# EAGLE schematic borrador_1 (EAGLE 9.5.2)
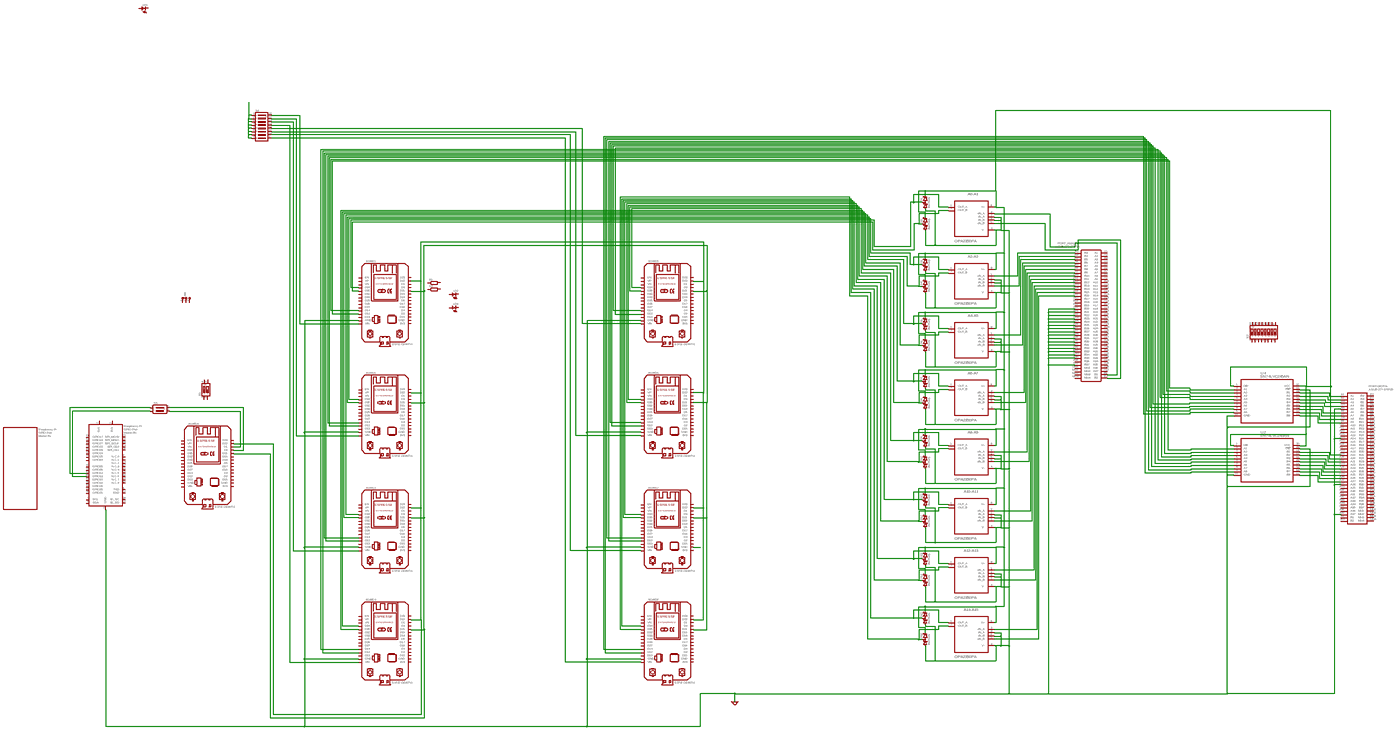
[diagram p0: schematic, sheet 1, overview]
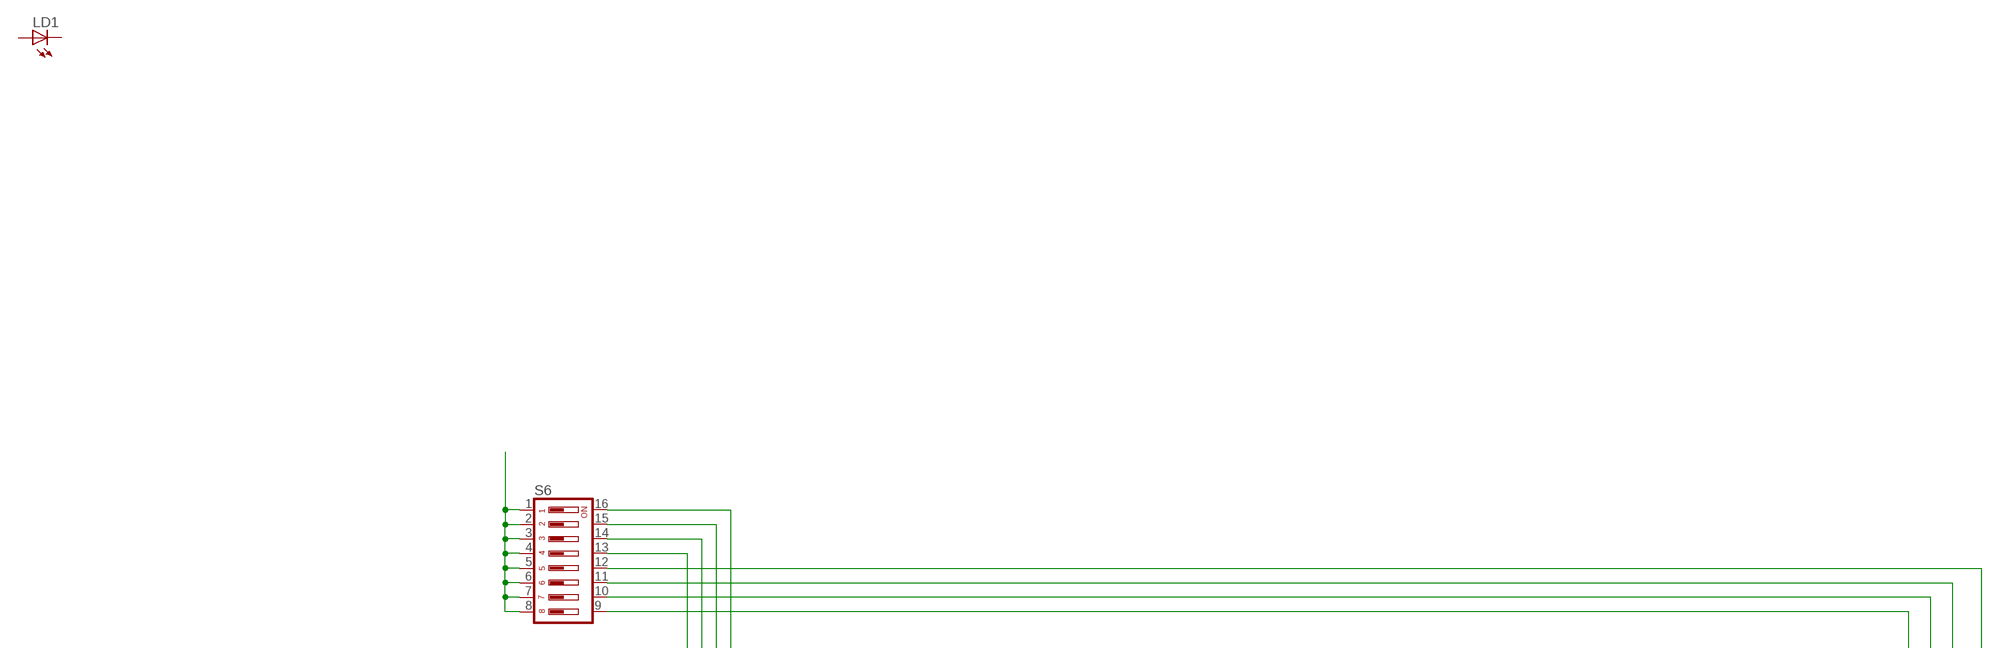
[diagram p1: schematic, sheet 1, part 1 of 4]
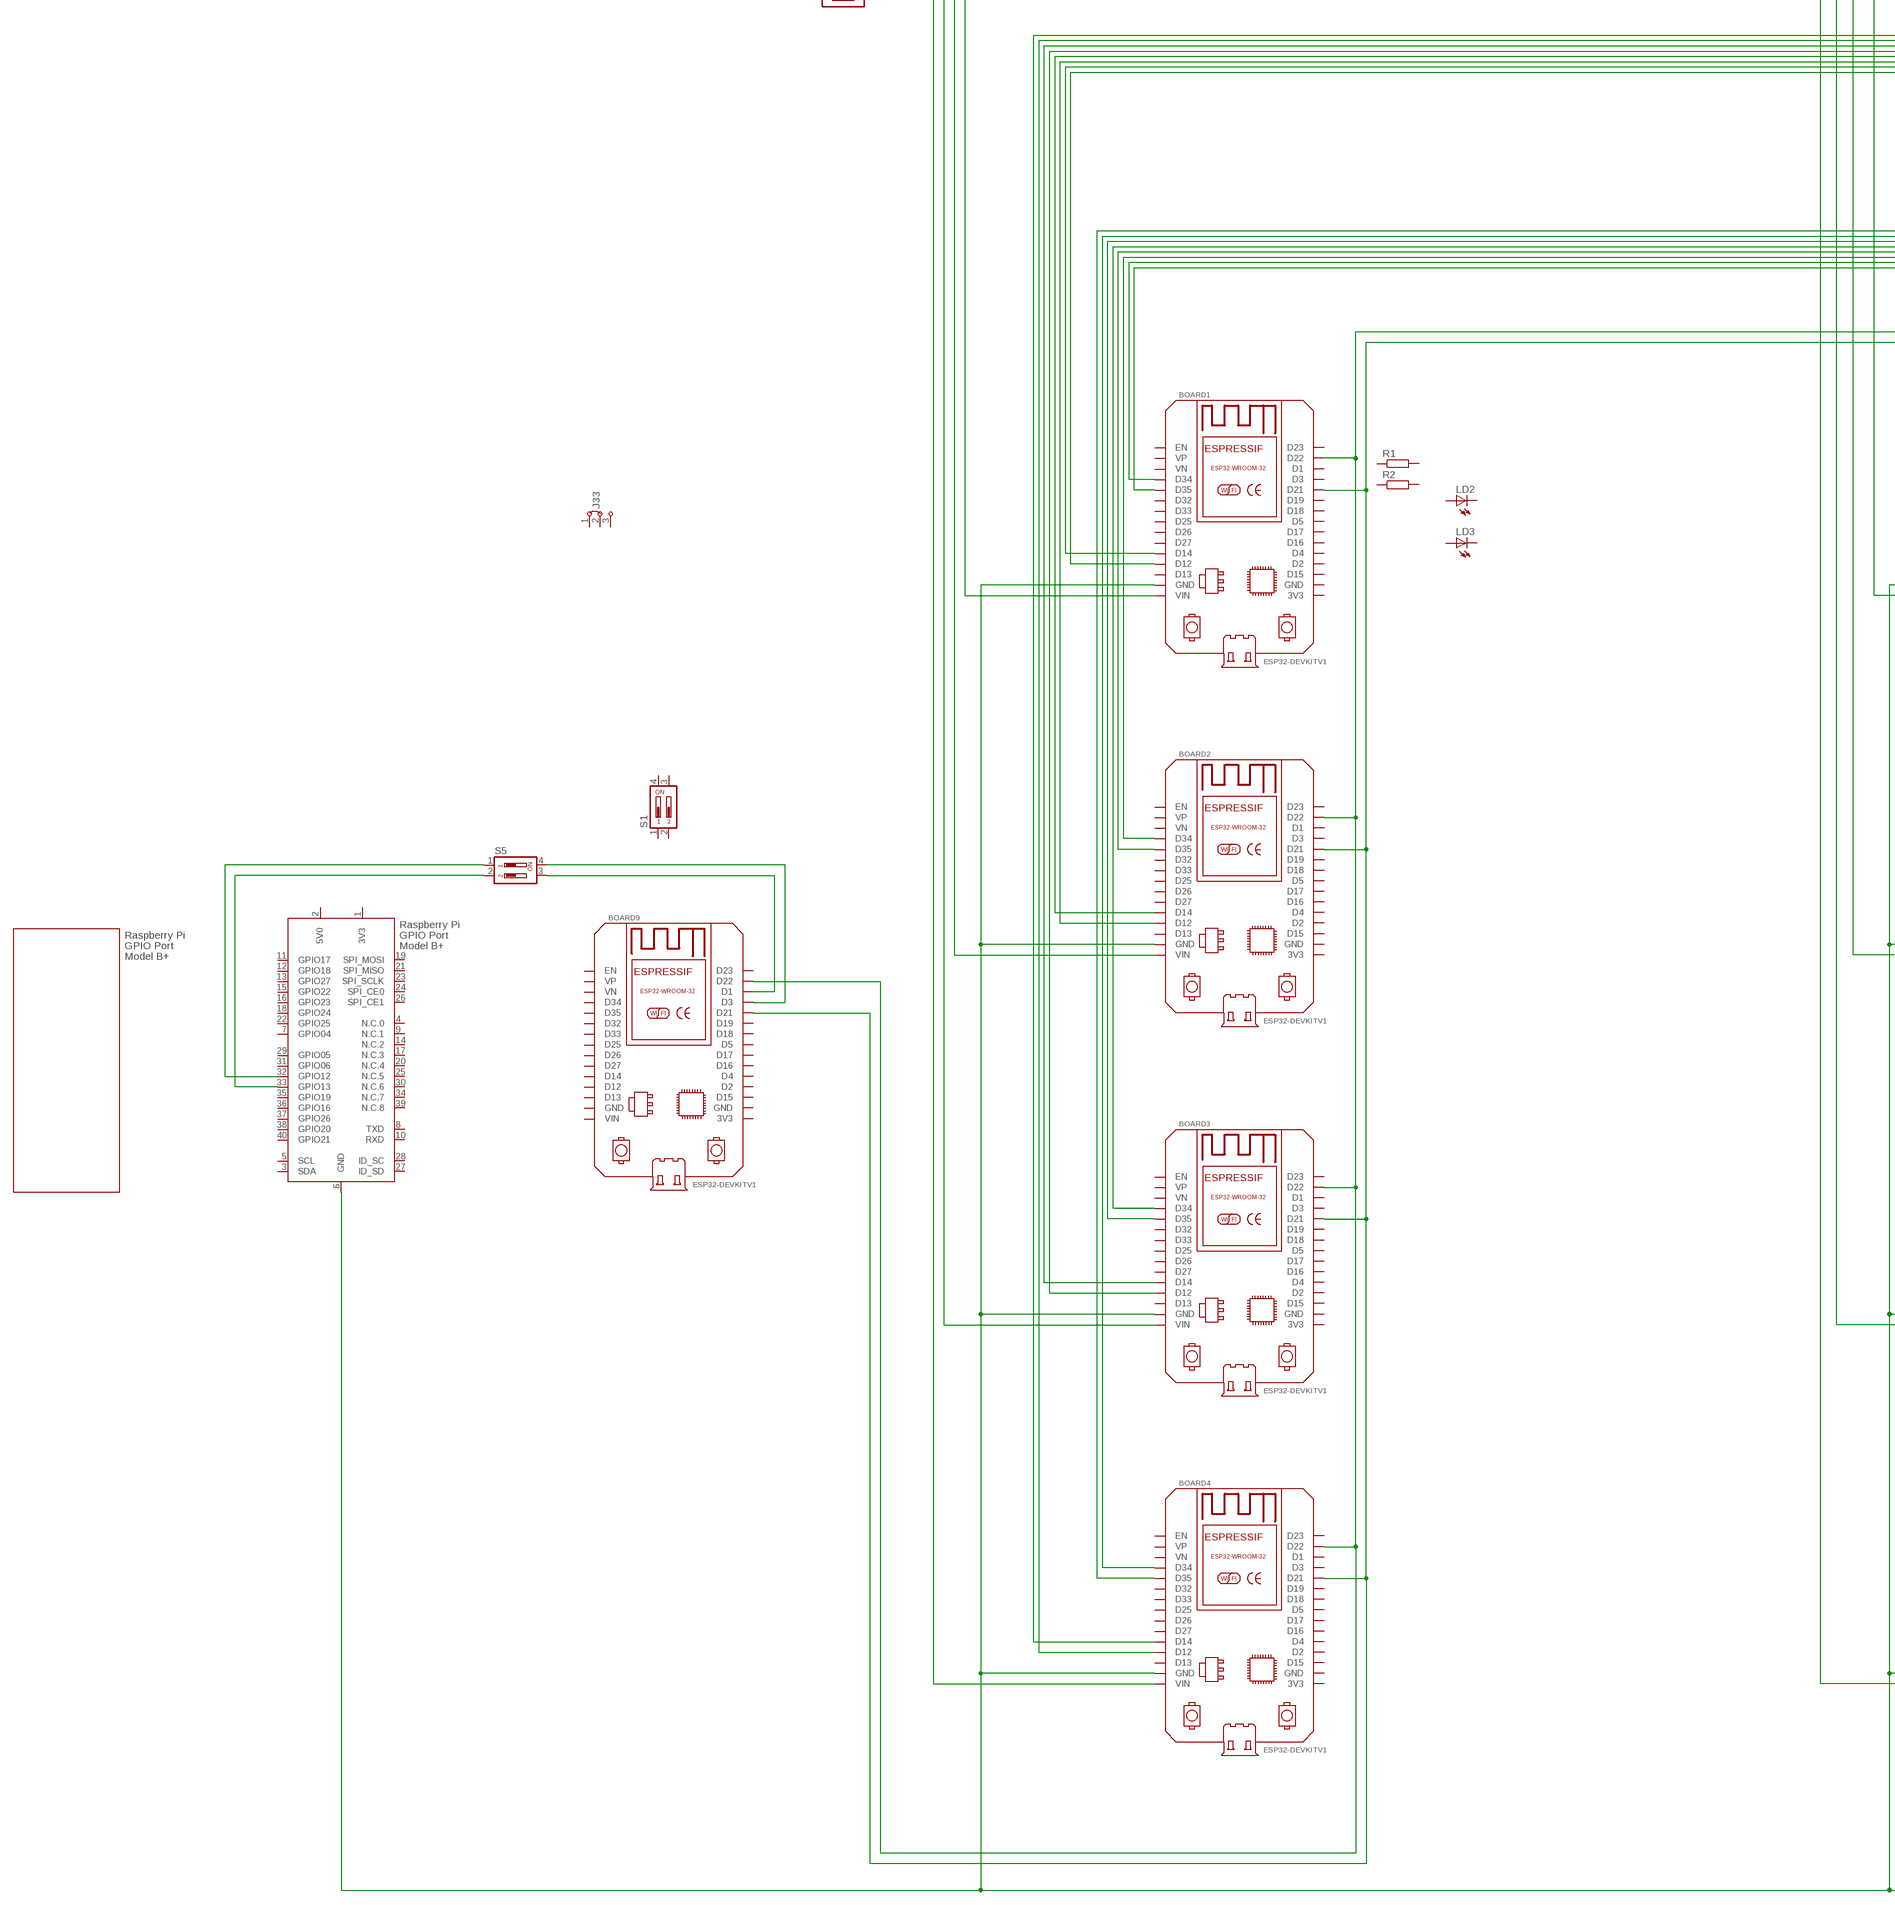
[diagram p2: schematic, sheet 1, part 2 of 4]
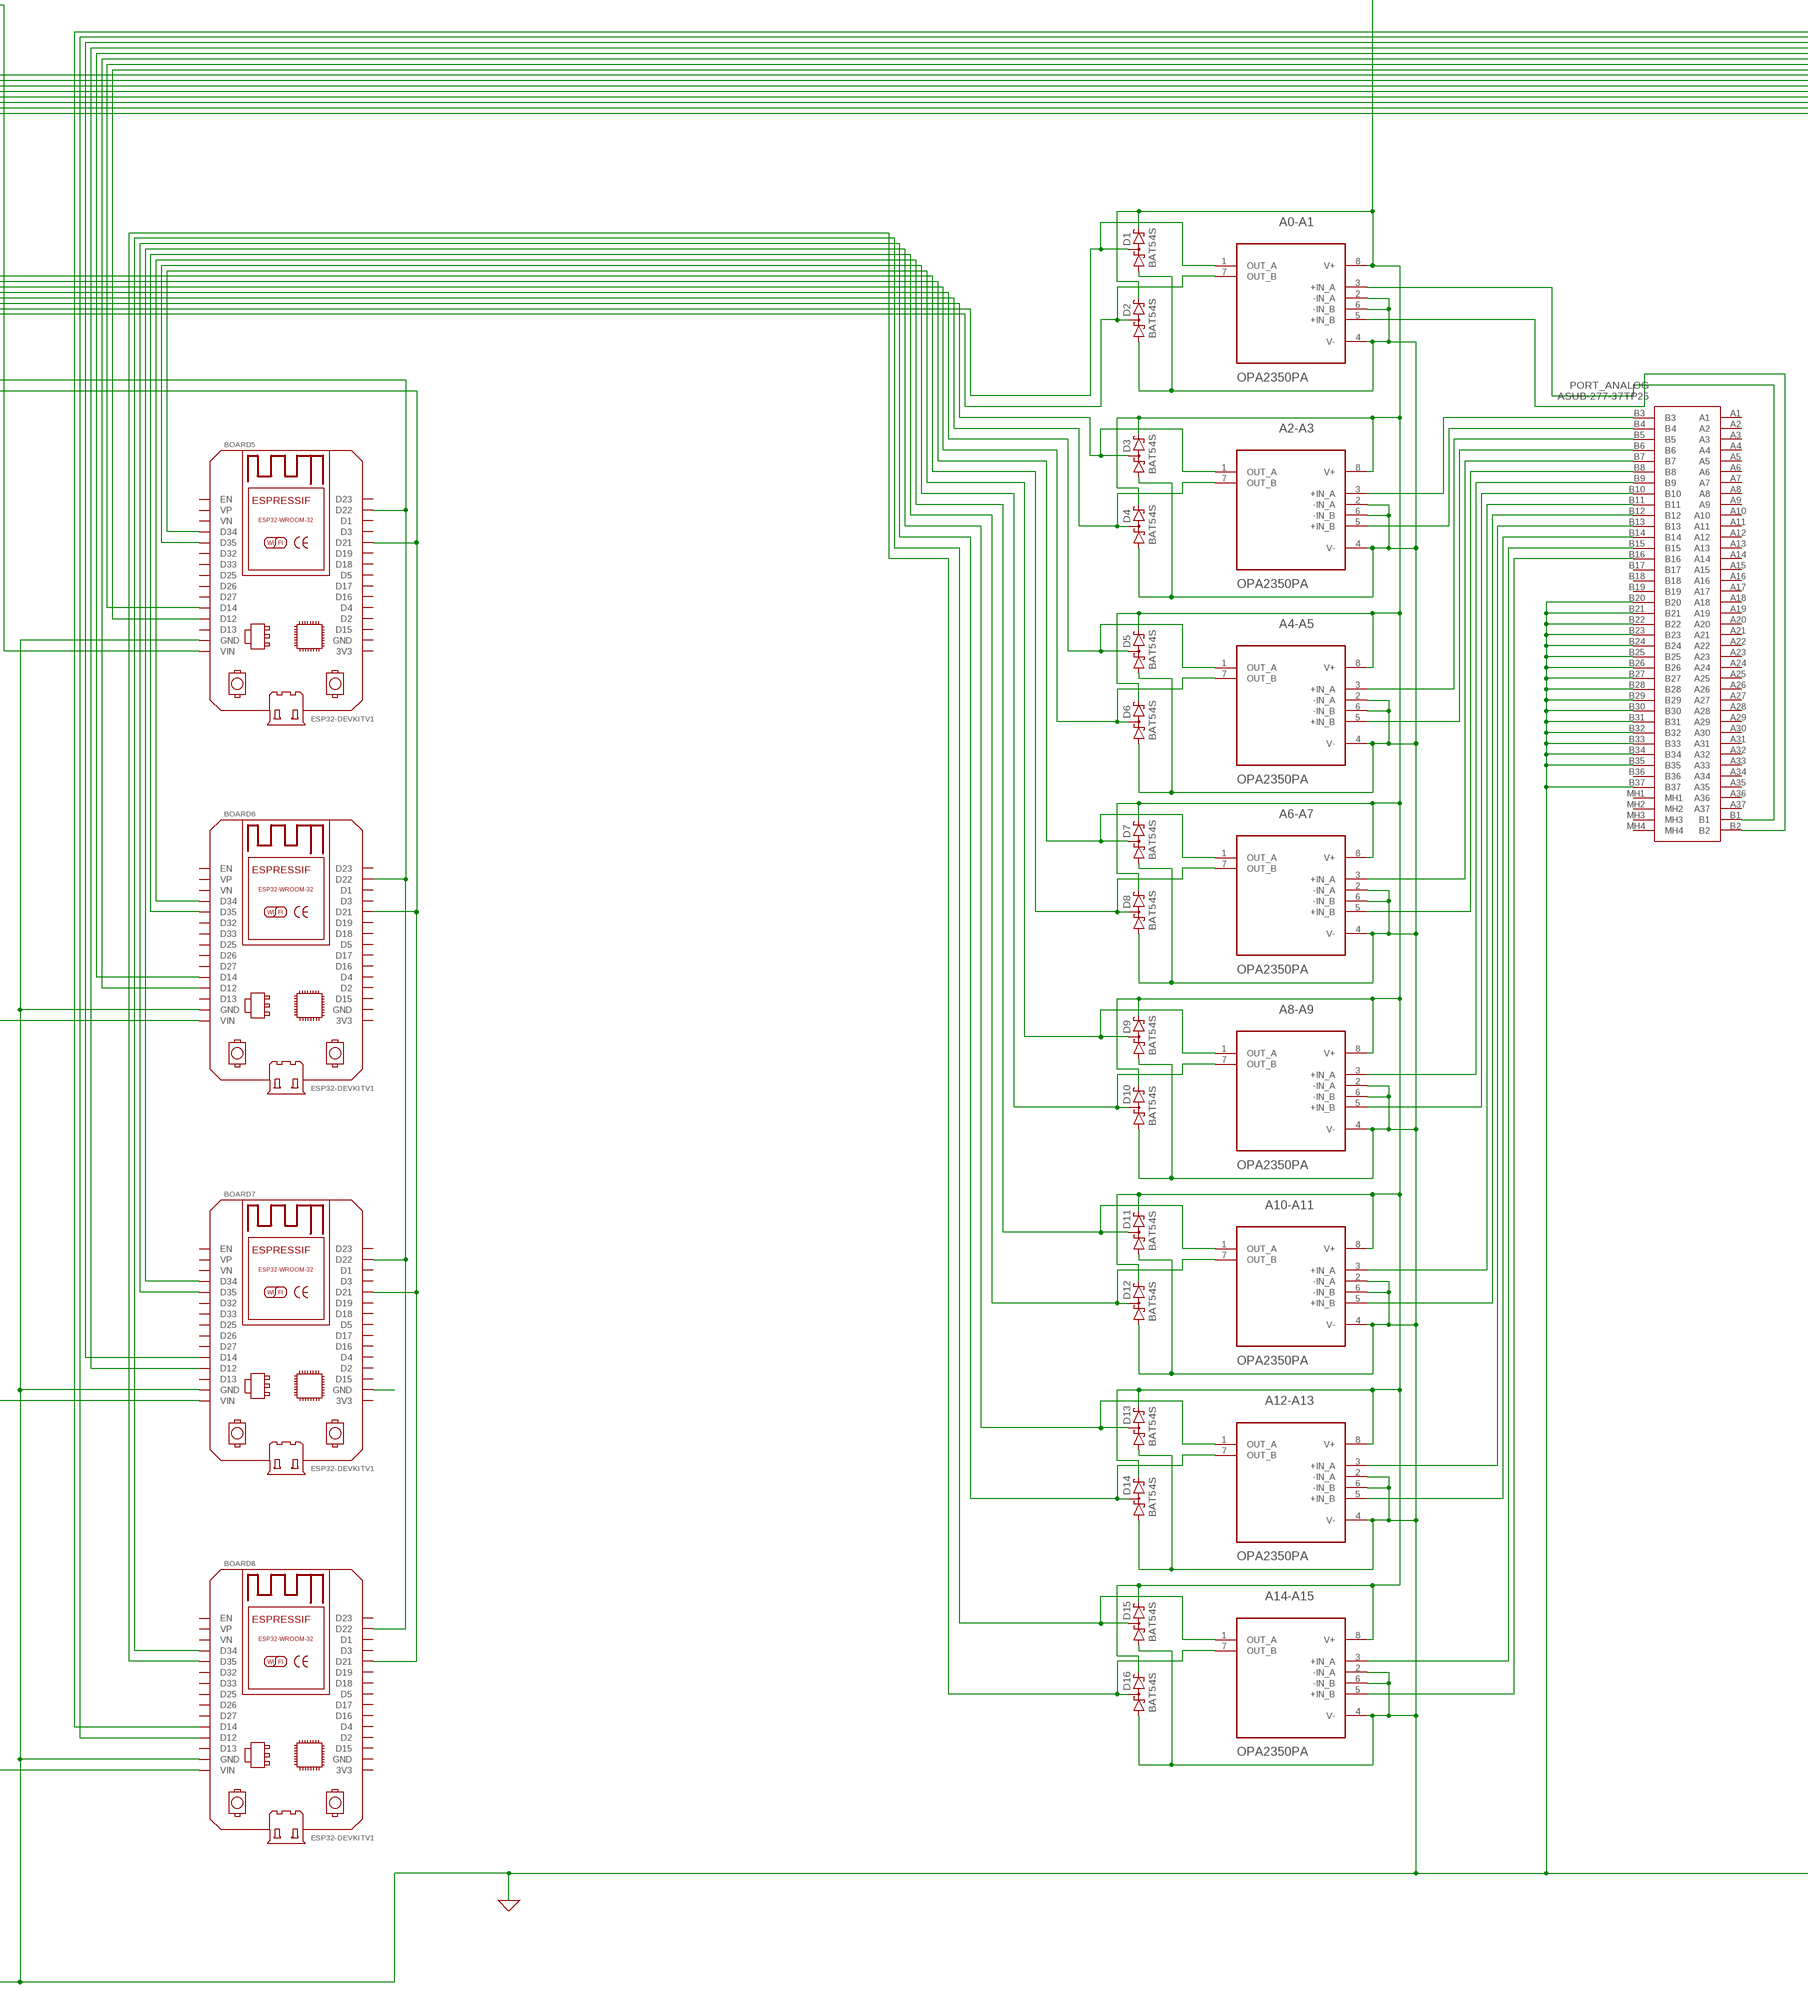
[diagram p3: schematic, sheet 1, part 3 of 4]
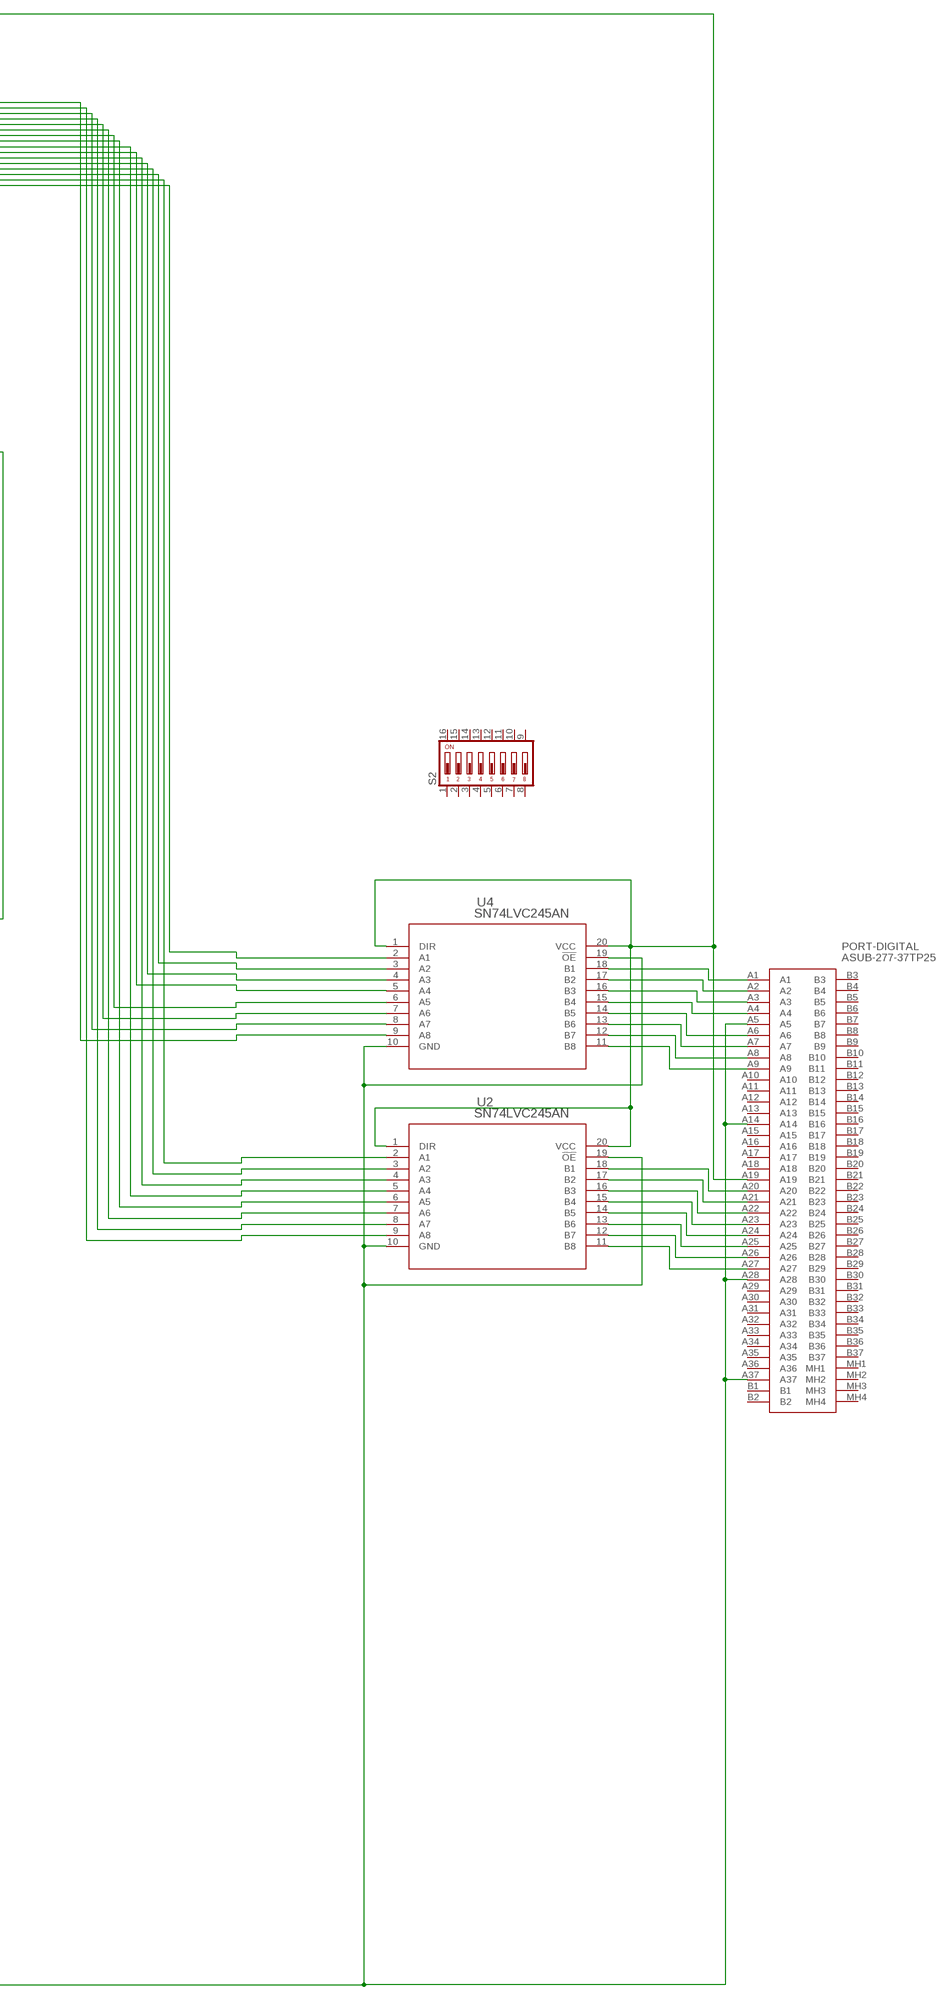
[diagram p4: schematic, sheet 1, part 4 of 4]

## Parts
A0-A1  OPA2350PA  [DIP254P762X508-8]
A2-A3  OPA2350PA  [DIP254P762X508-8]
A4-A5  OPA2350PA  [DIP254P762X508-8]
A6-A7  OPA2350PA  [DIP254P762X508-8]
A8-A9  OPA2350PA  [DIP254P762X508-8]
A10-A11  OPA2350PA  [DIP254P762X508-8]
A12-A13  OPA2350PA  [DIP254P762X508-8]
A14-A15  OPA2350PA  [DIP254P762X508-8]
BOARD1  ESP32DEVKITV1  [ESP32-DEVKITV1]
BOARD2  ESP32DEVKITV1  [ESP32-DEVKITV1]
BOARD3  ESP32DEVKITV1  [ESP32-DEVKITV1]
BOARD4  ESP32DEVKITV1  [ESP32-DEVKITV1]
BOARD5  ESP32DEVKITV1  [ESP32-DEVKITV1]
BOARD6  ESP32DEVKITV1  [ESP32-DEVKITV1]
BOARD7  ESP32DEVKITV1  [ESP32-DEVKITV1]
BOARD8  ESP32DEVKITV1  [ESP32-DEVKITV1]
BOARD9  ESP32DEVKITV1  [ESP32-DEVKITV1]
D1  BAT54S  [SOT23]
D2  BAT54S  [SOT23]
D3  BAT54S  [SOT23]
D4  BAT54S  [SOT23]
D5  BAT54S  [SOT23]
D6  BAT54S  [SOT23]
D7  BAT54S  [SOT23]
D8  BAT54S  [SOT23]
D9  BAT54S  [SOT23]
D10  BAT54S  [SOT23]
D11  BAT54S  [SOT23]
D12  BAT54S  [SOT23]
D13  BAT54S  [SOT23]
D14  BAT54S  [SOT23]
D15  BAT54S  [SOT23]
D16  BAT54S  [SOT23]
J33  J2X2MM  [04C]
LD1  LED3MM  [LED3MM]
LD2  LED3MM  [LED3MM]
LD3  LED3MM  [LED3MM]
PORT-DIGITAL  ASUB-277-37TP25  [ASUB27737TP25]
PORT_ANALOG  ASUB-277-37TP25  [ASUB27737TP25]
R1  R-EU_0207/10  [0207/10]
R2  R-EU_0207/10  [0207/10]
S1  DS02  [DS-02]
S2  DS08  [DS-08]
S5  DS02  [DS-02]
S6  DS08  [DS-08]
U2  SN74LVC245AN  [N20]
U4  SN74LVC245AN  [N20]
X1  RASPI_GPIO_B+_BOX  [RASPI_GPIO_B+_BOX]
X2  RASPI_BOARD_B+#_F  [RASPI_BOARD_B+_FULL]

## Nets
5V_MOD1: BOARD1.VIN S6.16
5V_MOD2: BOARD2.VIN S6.15
5V_MOD3: BOARD3.VIN S6.14
5V_MOD4: BOARD4.VIN S6.13
5V_MOD5: BOARD5.VIN S6.12
5V_MOD6: BOARD6.VIN S6.11
5V_MOD7: BOARD7.VIN S6.10
5V_MOD8: BOARD8.VIN S6.9
L_3V3: A0-A1.8(V+) A2-A3.8(V+) A4-A5.8(V+) A6-A7.8(V+) A8-A9.8(V+) A10-A11.8(V+) A12-A13.8(V+) A14-A15.8(V+) D1.2(C2) D2.2(C2) D3.2(C2) D4.2(C2) D5.2(C2) D6.2(C2) D7.2(C2) D8.2(C2) D9.2(C2) D10.2(C2) D11.2(C2) D12.2(C2) D13.2(C2) D14.2(C2) D15.2(C2) D16.2(C2) PORT-DIGITAL.A19 U2.1(DIR) U2.20(VCC) U4.1(DIR) U4.20(VCC)
L_5V: S6.1 S6.2 S6.3 S6.4 S6.5 S6.6 S6.7 S6.8
L_AO_0: A0-A1.1(OUT_A) BOARD1.D34 D1.3(C1A2)
L_AO_0_P: A0-A1.3(+IN_A) PORT_ANALOG.B1
L_AO_1: A0-A1.7(OUT_B) BOARD1.D35 D2.3(C1A2)
L_AO_1_P: A0-A1.5(+IN_B) PORT_ANALOG.B2
L_AO_2: A2-A3.1(OUT_A) BOARD2.D34 D3.3(C1A2)
L_AO_2_P: A2-A3.3(+IN_A) PORT_ANALOG.B3
L_AO_3: A2-A3.7(OUT_B) BOARD2.D35 D4.3(C1A2)
L_AO_3_P: A2-A3.5(+IN_B) PORT_ANALOG.B4
L_AO_4: A4-A5.1(OUT_A) BOARD3.D34 D5.3(C1A2)
L_AO_4_P: A4-A5.3(+IN_A) PORT_ANALOG.B5
L_AO_5: A4-A5.7(OUT_B) BOARD3.D35 D6.3(C1A2)
L_AO_5_P: A4-A5.5(+IN_B) PORT_ANALOG.B6
L_AO_6: A6-A7.1(OUT_A) BOARD4.D34 D7.3(C1A2)
L_AO_6_P: A6-A7.3(+IN_A) PORT_ANALOG.B7
L_AO_7: A6-A7.7(OUT_B) BOARD4.D35 D8.3(C1A2)
L_AO_7_P: A6-A7.5(+IN_B) PORT_ANALOG.B8
L_AO_8: A8-A9.1(OUT_A) BOARD5.D34 D9.3(C1A2)
L_AO_8_P: A8-A9.3(+IN_A) PORT_ANALOG.B9
L_AO_9: A8-A9.7(OUT_B) BOARD5.D35 D10.3(C1A2)
L_AO_9_P: A8-A9.5(+IN_B) PORT_ANALOG.B10
L_AO_10: A10-A11.1(OUT_A) BOARD6.D34 D11.3(C1A2)
L_AO_10_P: A10-A11.3(+IN_A) PORT_ANALOG.B11
L_AO_11: A10-A11.7(OUT_B) BOARD6.D35 D12.3(C1A2)
L_AO_11_P: A10-A11.5(+IN_B) PORT_ANALOG.B12
L_AO_12: A12-A13.1(OUT_A) BOARD7.D34 D13.3(C1A2)
L_AO_12_P: A12-A13.3(+IN_A) PORT_ANALOG.B13
L_AO_13: A12-A13.7(OUT_B) BOARD7.D35 D14.3(C1A2)
L_AO_13_P: A12-A13.5(+IN_B) PORT_ANALOG.B14
L_AO_14: A14-A15.1(OUT_A) BOARD8.D34 D15.3(C1A2)
L_AO_14_P: A14-A15.3(+IN_A) PORT_ANALOG.B15
L_AO_15: A14-A15.7(OUT_B) BOARD8.D35 D16.3(C1A2)
L_AO_15_P: A14-A15.5(+IN_B) PORT_ANALOG.B16
L_DI_0: BOARD1.D12 U4.2(A1)
L_DI_0_P: PORT-DIGITAL.A1 U4.18(B1)
L_DI_1: BOARD1.D14 U2.2(A1)
L_DI_1_P: PORT-DIGITAL.A20 U2.18(B1)
L_DI_2: BOARD2.D12 U4.3(A2)
L_DI_2_P: PORT-DIGITAL.A2 U4.17(B2)
L_DI_3: BOARD2.D14 U2.3(A2)
L_DI_3_P: PORT-DIGITAL.A21 U2.17(B2)
L_DI_4: BOARD3.D12 U4.4(A3)
L_DI_4_P: PORT-DIGITAL.A3 U4.16(B3)
L_DI_5: BOARD3.D14 U2.4(A3)
L_DI_5_P: PORT-DIGITAL.A22 U2.16(B3)
L_DI_6: BOARD4.D12 U4.5(A4)
L_DI_6_P: PORT-DIGITAL.A4 U4.15(B4)
L_DI_7: BOARD4.D14 U2.5(A4)
L_DI_7_P: PORT-DIGITAL.A23 U2.15(B4)
L_DI_8: BOARD5.D12 U2.6(A5)
L_DI_8_P: PORT-DIGITAL.A24 U2.14(B5)
L_DI_9: BOARD5.D14 U4.6(A5)
L_DI_9_P: PORT-DIGITAL.A6 U4.14(B5)
L_DI_10: BOARD6.D12 U2.7(A6)
L_DI_10_P: PORT-DIGITAL.A25 U2.13(B6)
L_DI_11: BOARD6.D14 U4.7(A6)
L_DI_11_P: PORT-DIGITAL.A7 U4.13(B6)
L_DI_012: BOARD7.D12 U2.8(A7)
L_DI_12_P: PORT-DIGITAL.A26 U2.12(B7)
L_DI_13: BOARD7.D14 U4.8(A7)
L_DI_13_P: PORT-DIGITAL.A8 U4.12(B7)
L_DI_014: BOARD8.D12 U2.9(A8)
L_DI_14_P: PORT-DIGITAL.A27 U2.11(B8)
L_DI_015: BOARD8.D14 U4.9(A8)
L_DI_15_P: PORT-DIGITAL.A9 U4.11(B8)
L_GROUND: A0-A1.2(-IN_A) A0-A1.4(V-) A0-A1.6(-IN_B) A2-A3.2(-IN_A) A2-A3.4(V-) A2-A3.6(-IN_B) A4-A5.2(-IN_A) A4-A5.4(V-) A4-A5.6(-IN_B) A6-A7.2(-IN_A) A6-A7.4(V-) A6-A7.6(-IN_B) A8-A9.2(-IN_A) A8-A9.4(V-) A8-A9.6(-IN_B) A10-A11.2(-IN_A) A10-A11.4(V-) A10-A11.6(-IN_B) A12-A13.2(-IN_A) A12-A13.4(V-) A12-A13.6(-IN_B) A14-A15.2(-IN_A) A14-A15.4(V-) A14-A15.6(-IN_B) BOARD1.GND BOARD2.GND BOARD3.GND BOARD4.GND BOARD5.GND BOARD6.GND BOARD7.GND BOARD8.GND D1.1(A1) D2.1(A1) D3.1(A1) D4.1(A1) D5.1(A1) D6.1(A1) D7.1(A1) D8.1(A1) D9.1(A1) D10.1(A1) D11.1(A1) D12.1(A1) D13.1(A1) D14.1(A1) D15.1(A1) D16.1(A1) PORT-DIGITAL.A5 PORT-DIGITAL.A14 PORT-DIGITAL.A28 PORT-DIGITAL.A37 PORT_ANALOG.B20 PORT_ANALOG.B21 PORT_ANALOG.B22 PORT_ANALOG.B23 PORT_ANALOG.B24 PORT_ANALOG.B25 PORT_ANALOG.B26 PORT_ANALOG.B27 PORT_ANALOG.B28 PORT_ANALOG.B29 PORT_ANALOG.B30 PORT_ANALOG.B31 PORT_ANALOG.B32 PORT_ANALOG.B33 PORT_ANALOG.B34 PORT_ANALOG.B35 PORT_ANALOG.B37 U2.10(GND) U2.19(!OE) U4.10(GND) U4.19(!OE) X1.6(GND) ; supply symbol labelled GND
L_SCL: BOARD1.D22 BOARD2.D22 BOARD3.D22 BOARD4.D22 BOARD5.D22 BOARD6.D22 BOARD7.D22 BOARD8.D22 BOARD9.D22
L_SDA: BOARD1.D21 BOARD2.D21 BOARD3.D21 BOARD4.D21 BOARD5.D21 BOARD6.D21 BOARD7.D21 BOARD8.D21 BOARD9.D21
N$1: S5.2 X1.33(GPIO13)
N$2: BOARD7.GND@1(GND)
N$3: S5.1 X1.32(GPIO12)
N$4: BOARD9.D3 S5.4
N$5: BOARD9.D1 S5.3
Unconnected: BOARD1.3V3 BOARD1.D1 BOARD1.D2 BOARD1.D3 BOARD1.D4 BOARD1.D5 BOARD1.D13 BOARD1.D15 BOARD1.D16 BOARD1.D17 BOARD1.D18 BOARD1.D19 BOARD1.D23 BOARD1.D25 BOARD1.D26 BOARD1.D27 BOARD1.D32 BOARD1.D33 BOARD1.EN BOARD1.GND@1(GND) BOARD1.VN BOARD1.VP BOARD2.3V3 BOARD2.D1 BOARD2.D2 BOARD2.D3 BOARD2.D4 BOARD2.D5 BOARD2.D13 BOARD2.D15 BOARD2.D16 BOARD2.D17 BOARD2.D18 BOARD2.D19 BOARD2.D23 BOARD2.D25 BOARD2.D26 BOARD2.D27 BOARD2.D32 BOARD2.D33 BOARD2.EN BOARD2.GND@1(GND) BOARD2.VN BOARD2.VP BOARD3.3V3 BOARD3.D1 BOARD3.D2 BOARD3.D3 BOARD3.D4 BOARD3.D5 BOARD3.D13 BOARD3.D15 BOARD3.D16 BOARD3.D17 BOARD3.D18 BOARD3.D19 BOARD3.D23 BOARD3.D25 BOARD3.D26 BOARD3.D27 BOARD3.D32 BOARD3.D33 BOARD3.EN BOARD3.GND@1(GND) BOARD3.VN BOARD3.VP BOARD4.3V3 BOARD4.D1 BOARD4.D2 BOARD4.D3 BOARD4.D4 BOARD4.D5 BOARD4.D13 BOARD4.D15 BOARD4.D16 BOARD4.D17 BOARD4.D18 BOARD4.D19 BOARD4.D23 BOARD4.D25 BOARD4.D26 BOARD4.D27 BOARD4.D32 BOARD4.D33 BOARD4.EN BOARD4.GND@1(GND) BOARD4.VN BOARD4.VP BOARD5.3V3 BOARD5.D1 BOARD5.D2 BOARD5.D3 BOARD5.D4 BOARD5.D5 BOARD5.D13 BOARD5.D15 BOARD5.D16 BOARD5.D17 BOARD5.D18 BOARD5.D19 BOARD5.D23 BOARD5.D25 BOARD5.D26 BOARD5.D27 BOARD5.D32 BOARD5.D33 BOARD5.EN BOARD5.GND@1(GND) BOARD5.VN BOARD5.VP BOARD6.3V3 BOARD6.D1 BOARD6.D2 BOARD6.D3 BOARD6.D4 BOARD6.D5 BOARD6.D13 BOARD6.D15 BOARD6.D16 BOARD6.D17 BOARD6.D18 BOARD6.D19 BOARD6.D23 BOARD6.D25 BOARD6.D26 BOARD6.D27 BOARD6.D32 BOARD6.D33 BOARD6.EN BOARD6.GND@1(GND) BOARD6.VN BOARD6.VP BOARD7.3V3 BOARD7.D1 BOARD7.D2 BOARD7.D3 BOARD7.D4 BOARD7.D5 BOARD7.D13 BOARD7.D15 BOARD7.D16 BOARD7.D17 BOARD7.D18 BOARD7.D19 BOARD7.D23 BOARD7.D25 BOARD7.D26 BOARD7.D27 BOARD7.D32 BOARD7.D33 BOARD7.EN BOARD7.VN BOARD7.VP BOARD8.3V3 BOARD8.D1 BOARD8.D2 BOARD8.D3 BOARD8.D4 BOARD8.D5 BOARD8.D13 BOARD8.D15 BOARD8.D16 BOARD8.D17 BOARD8.D18 BOARD8.D19 BOARD8.D23 BOARD8.D25 BOARD8.D26 BOARD8.D27 BOARD8.D32 BOARD8.D33 BOARD8.EN BOARD8.GND@1(GND) BOARD8.VN BOARD8.VP BOARD9.3V3 BOARD9.D2 BOARD9.D4 BOARD9.D5 BOARD9.D12 BOARD9.D13 BOARD9.D14 BOARD9.D15 BOARD9.D16 BOARD9.D17 BOARD9.D18 BOARD9.D19 BOARD9.D23 BOARD9.D25 BOARD9.D26 BOARD9.D27 BOARD9.D32 BOARD9.D33 BOARD9.D34 BOARD9.D35 BOARD9.EN BOARD9.GND BOARD9.GND@1(GND) BOARD9.VIN BOARD9.VN BOARD9.VP J33.1 J33.2 J33.3 LD1.A LD1.K(C) LD2.A LD2.K(C) LD3.A LD3.K(C) PORT-DIGITAL.A10 PORT-DIGITAL.A11 PORT-DIGITAL.A12 PORT-DIGITAL.A13 PORT-DIGITAL.A15 PORT-DIGITAL.A16 PORT-DIGITAL.A17 PORT-DIGITAL.A18 PORT-DIGITAL.A29 PORT-DIGITAL.A30 PORT-DIGITAL.A31 PORT-DIGITAL.A32 PORT-DIGITAL.A33 PORT-DIGITAL.A34 PORT-DIGITAL.A35 PORT-DIGITAL.A36 PORT-DIGITAL.B1 PORT-DIGITAL.B2 PORT-DIGITAL.B3 PORT-DIGITAL.B4 PORT-DIGITAL.B5 PORT-DIGITAL.B6 PORT-DIGITAL.B7 PORT-DIGITAL.B8 PORT-DIGITAL.B9 PORT-DIGITAL.B10 PORT-DIGITAL.B11 PORT-DIGITAL.B12 PORT-DIGITAL.B13 PORT-DIGITAL.B14 PORT-DIGITAL.B15 PORT-DIGITAL.B16 PORT-DIGITAL.B17 PORT-DIGITAL.B18 PORT-DIGITAL.B19 PORT-DIGITAL.B20 PORT-DIGITAL.B21 PORT-DIGITAL.B22 PORT-DIGITAL.B23 PORT-DIGITAL.B24 PORT-DIGITAL.B25 PORT-DIGITAL.B26 PORT-DIGITAL.B27 PORT-DIGITAL.B28 PORT-DIGITAL.B29 PORT-DIGITAL.B30 PORT-DIGITAL.B31 PORT-DIGITAL.B32 PORT-DIGITAL.B33 PORT-DIGITAL.B34 PORT-DIGITAL.B35 PORT-DIGITAL.B36 PORT-DIGITAL.B37 PORT-DIGITAL.MH1 PORT-DIGITAL.MH2 PORT-DIGITAL.MH3 PORT-DIGITAL.MH4 PORT_ANALOG.A1 PORT_ANALOG.A2 PORT_ANALOG.A3 PORT_ANALOG.A4 PORT_ANALOG.A5 PORT_ANALOG.A6 PORT_ANALOG.A7 PORT_ANALOG.A8 PORT_ANALOG.A9 PORT_ANALOG.A10 PORT_ANALOG.A11 PORT_ANALOG.A12 PORT_ANALOG.A13 PORT_ANALOG.A14 PORT_ANALOG.A15 PORT_ANALOG.A16 PORT_ANALOG.A17 PORT_ANALOG.A18 PORT_ANALOG.A19 PORT_ANALOG.A20 PORT_ANALOG.A21 PORT_ANALOG.A22 PORT_ANALOG.A23 PORT_ANALOG.A24 PORT_ANALOG.A25 PORT_ANALOG.A26 PORT_ANALOG.A27 PORT_ANALOG.A28 PORT_ANALOG.A29 PORT_ANALOG.A30 PORT_ANALOG.A31 PORT_ANALOG.A32 PORT_ANALOG.A33 PORT_ANALOG.A34 PORT_ANALOG.A35 PORT_ANALOG.A36 PORT_ANALOG.A37 PORT_ANALOG.B17 PORT_ANALOG.B18 PORT_ANALOG.B19 PORT_ANALOG.B36 PORT_ANALOG.MH1 PORT_ANALOG.MH2 PORT_ANALOG.MH3 PORT_ANALOG.MH4 R1.1 R1.2 R2.1 R2.2 S1.1 S1.2 S1.3 S1.4 S2.1 S2.2 S2.3 S2.4 S2.5 S2.6 S2.7 S2.8 S2.9 S2.10 S2.11 S2.12 S2.13 S2.14 S2.15 S2.16 X1.3(SDA) X1.4(N.C.0) X1.5(SCL) X1.7(GPIO04) X1.8(TXD) X1.9(N.C.1) X1.10(RXD) X1.11(GPIO17) X1.12(GPIO18) X1.13(GPIO27) X1.14(N.C.2) X1.15(GPIO22) X1.16(GPIO23) X1.17(N.C.3) X1.18(GPIO24) X1.19(SPI_MOSI) X1.20(N.C.4) X1.21(SPI_MISO) X1.22(GPIO25) X1.23(SPI_SCLK) X1.24(SPI_CE0) X1.25(N.C.5) X1.26(SPI_CE1) X1.27(ID_SD) X1.28(ID_SC) X1.29(GPIO05) X1.30(N.C.6) X1.31(GPIO06) X1.34(N.C.7) X1.35(GPIO19) X1.36(GPIO16) X1.37(GPIO26) X1.38(GPIO20) X1.39(N.C.8) X1.40(GPIO21)

## Power pins joined to a net without a drawn wire
3V3: X1.1(3V3)
5V0: X1.2(5V0)

## Library data of the parts
A0-A1 A2-A3 A4-A5 A6-A7 A8-A9 A10-A11 A12-A13 A14-A15 = Texas Instruments_By_element14_Batch_1:OPA2350PA: OPERATIONAL AMPLIFIER; MPN: OPA2350PA; OC_FARNELL: 4353316; OC_NEWARK: 75C4730; PACKAGE: PDIP; SUPPLIER: Texas Instruments
BOARD1-BOARD9 = ESP32-DEVKITV1:ESP32DEVKITV1: https://github.com/shridattdudhat
D1-D16 = diode:BAT54S: Schottky Diodes Pin connection corrected 2011-05-04 Source: Fairchild .. BAT54.pdf
J33 = jumper:J2: Jumper switch 2 x 2.5 mm
LD1-LD3 = led:LED: LED OSRAM: - CHIPLED LG R971, LG N971, LY N971, LG Q971, LY Q971, LO R971, LY R971 LH N974, LH R974 LS Q976, LO Q976, LY Q976 LO Q996 - Hyper CHIPLED LW Q18S LB Q993, LB Q99A, LB R99A - SideLED LS A670, LO A670, LY A670, LG A670, LP A670 LB A673, LV A673, LT A673, LW A673 LH A674 LY A675 LS A676, LA A676, LO A676, LY A676, LW A676 LS A679, LY A679, LG A679 - Hyper Micro SIDELED® LS Y876, LA Y876, LO Y876, LY Y876 LT Y87S - SmartLED LW L88C, LW L88S LB L89C, LB L89S, LG L890 LS L89K, LO L89K, LY L89K LS L896, LA L896, LO L896, LY L896 - TOPLED LS T670, LO T670, LY T670, LG T670, LP T670 LSG T670, LSP T670, LSY T670, LOP T670, LYG T670 LG T671, LOG T671, LSG T671 LB T673, LV T673, LT T673, LW T673 LH T674 LS T676, LA T676, LO T676, LY T676, LB T676, LH T676, LSB T676, LW T676 LB T67C, LV T67C, LT T67C, LS T67K, LO T67K, LY T67K, LW E67C LS E67B, LA E67B, LO E67B, LY E67B, LB E67C, LV E67C, LT E67C LW T67C LS T679, LY T679, LG T679 LS T770, LO T770, LY T770, LG T770, LP T770 LB T773, LV T773, LT T773, LW T773 LH T774 LS E675, LA E675, LY E675, LS T675 LS T776, LA T776, LO T776, LY T776, LB T776 LHGB T686 LT T68C, LB T68C - Hyper Mini TOPLED® LB M676 - Mini TOPLED Santana® LG M470 LS M47K, LO M47K, LY M47K Source: http://www.osram.convergy.de/
PORT-DIGITAL PORT_ANALOG = ASUB-277-37TP25:ASUB-277-37TP25: CONN D-SUB PLUG/RCPT 37P R/A SLD Source: Datasheet <https://datasheet.datasheetarchive.com/originals/dk/DKDS-12/220594.pdf>; DESCRIPTION: CONN D-SUB PLUG/RCPT 37P R/A SLD; HEIGHT: 31.55mm; MANUFACTURER_NAME: ASSMANN WSW components GmbH; MANUFACTURER_PART_NUMBER: ASUB-277-37TP25
R1 R2 = resistor:R-EU_: RESISTOR, European symbol
S1 S5 = switch-dil:DS02: DIL/CODE SWITCH; OC_FARNELL: 9472126; OC_NEWARK: unknown
S2 S6 = switch-dil:DS08: DIL/CODE SWITCH; MPN: DS08; OC_FARNELL: unknown; OC_NEWARK: 73J0071
U2 U4 = lc245a:SN74LVC245AN; DATASHEET_URL: http://www.ti.com/lit/gpn/SN74LVC245A; DESCRIPTION: Octal Bus Transceiver With 3-State Outputs; FAMILY_NAME: STANDARD TRANSCEIVER; GENERIC_PART_NUMBER: SN74LVC245A; INDUSTRY_STD_PKG_TYPE: PDIP; MANUFACTURER: Texas Instruments; MANUFACTURER_PART_NUMBER: SN74LVC245AN; PACKAGE_DESIGNATOR: N; PIN_COUNT: 20; VENDOR: Texas Instruments
X1 = raspberrypi_bastelstube_v13:RASPI_GPIO_B+: Only the 2x20 header connector, nothing else
X2 = Rasp_board:RASPI_BOARD_B+#: Raspberry Pi GPIO connector with markings for the outer dimensions of the Raspberry Pi board model B+ with different sets of drill holes or mounting pads All pins connected